# EAGLE design PoEpi_v2 (EAGLE 6.2)
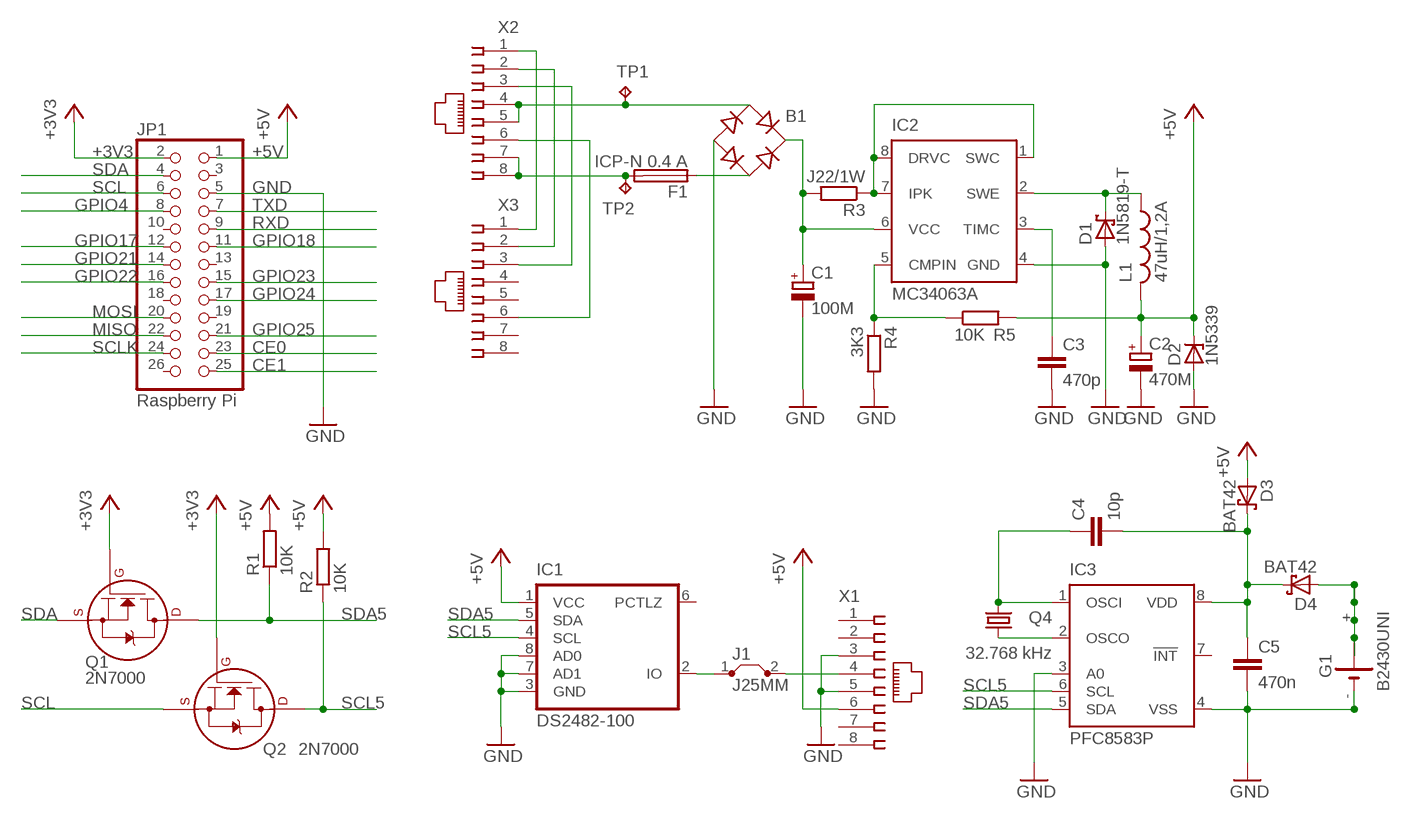
[diagram p0: schematic, sheet 1]

## Parts
B1  B-DIL  [B-DIL]
C1  100M  CPOL-EUE3.5-8  [E3,5-8]
C2  470M  CPOL-EUE3.5-8  [E3,5-8]
C3  470p  C-EU050-024X044  [C050-024X044]
C4  10p  C-EU050-024X044  [C050-024X044]
C5  470n  C-EU050-024X044  [C050-024X044]
D1  1N5819-T  [DO41-7.6]
D2  1N5339  1N5333  [C1702-15]
D3  BAT42  [DO35-10]
D4  BAT42  [DO35-10]
F1  ICP-N 0.4 A  FUSETO92-2  [TO92-2]
G1  B2430UNI  [B2430UNI]
IC1  DS2482-100  [SO08]
IC2  MC34063A  [DIL8]
IC3  PFC8583P  [DIL08]
J1  J25MM  [25]
JP1  Raspberry Pi  PINHD-2X13INV  [2X13]
L1  47uH/1,2A  L-US6000-XXX-RC  [6000-XXXX-RC]
Q1  2N7000  2N700_TO92-  [TO92-]
Q2  2N7000  2N700_TO92-  [TO92-]
Q4  32.768 kHz  CRYSTALTC26V  [TC26V]
R1  10K  R-EU_0204/7  [0204/7]
R2  10K  R-EU_0204/7  [0204/7]
R3  J22/1W  R-EU_0617/17  [0617/17]
R4  3K3  R-EU_0204/7  [0204/7]
R5  10K  R-EU_0204/7  [0204/7]
TP1  TPPAD1-13Y  [P1-13Y]
TP2  TPPAD1-13Y  [P1-13Y]
X1  520251-4  [520251-4]
X2  520251-4  [520251-4]
X3  520251-4  [520251-4]

## Nets
+3V3: JP1.2 Q1.2(G) Q2.2(G)
+5V: C2.+ D2.C D3.A IC1.1(VCC) JP1.1 L1.2 R1.2 R2.2 R5.2 X1.6
+BAT: D4.A G1.+ G1.+@1(+) G1.+@2(+) G1.+@3(+) G1.+@4(+)
+VSB: C4.2 C5.1 D3.C D4.C IC3.8(VDD)
CE0: JP1.23
CE1: JP1.25
GND: B1.- C1.- C2.- C3.2 C5.2 D1.A D2.A G1.- G1.-@1(-) IC1.3(GND) IC1.7(AD1) IC1.8(AD0) IC2.4(GND) IC3.3(A0) IC3.4(VSS) JP1.5 R4.2 X1.3 X1.5
GPIO4: JP1.8
GPIO17: JP1.12
GPIO18: JP1.11
GPIO21: JP1.14
GPIO22: JP1.16
GPIO23: JP1.15
GPIO24: JP1.17
GPIO25: JP1.21
MISO: JP1.22
MOSI: JP1.20
N$1: X2.1 X3.1
N$2: X2.2 X3.2
N$3: X2.3 X3.3
N$4: X2.6 X3.6
N$5: F1.3 TP2.TP X2.7 X2.8
N$6: B1.AC1 TP1.TP X2.4 X2.5
N$7: IC2.1(SWC) IC2.7(IPK) IC2.8(DRVC) R3.1
N$8: IC2.5(CMPIN) R4.1 R5.1
N$9: B1.+ C1.+ IC2.6(VCC) R3.2
N$10: C3.1 IC2.3(TIMC)
N$12: D1.C IC2.2(SWE) L1.1
N$14: B1.AC2 F1.1
N$15: IC3.2(OSCO) Q4.1
N$16: C4.1 IC3.1(OSCI) Q4.2
ONEWIRE: IC1.2(IO) J1.1
ONEWIRE2: J1.2 X1.4
RXD: JP1.9
SCL: JP1.6 Q2.3(S)
SCL5: IC1.4(SCL) IC3.6(SCL) Q2.1(D) R2.1
SCLK: JP1.24
SDA: JP1.4 Q1.3(S)
SDA5: IC1.5(SDA) IC3.5(SDA) Q1.1(D) R1.1
TXD: JP1.7
Unconnected: IC1.6(PCTLZ) IC3.7(!INT) JP1.3 JP1.10 JP1.13 JP1.18 JP1.19 JP1.26 X1.1 X1.2 X1.7 X1.8 X3.4 X3.5 X3.7 X3.8

## Library data of the parts
B1 = rectifier:B-DIL: RECTIFIER
C1 C2 = rcl:CPOL-EU: POLARIZED CAPACITOR, European symbol
C3-C5 = rcl:C-EU: CAPACITOR, European symbol
D1 = diode:1N581*: 1.0A SCHOTTKY BARRIER RECTIFIER Source: http://www.diodes.com/datasheets/ds23001.pdf
D2 = diode:1N5333: Z DIODE 3.3 V, 5W, 5 percent (Motorola)
D3 D4 = diode:BAT42: DIODE barrier diode
F1 = myparts:FUSE: Fuse
G1 = battery:B2430UNI: LI BATTERY
IC1 = parts:DS2482-100: Single channel 1-Wire master with I2C interface
IC2 = parts:MC34063A
IC3 = micro-philips:PFC8583: I2C-Bus CLOCK/CALENDAR; OC_FARNELL: unknown; OC_NEWARK: unknown
J1 = jumper:J: Bridge
JP1 = myparts:PINHD-2X13: PIN HEADER - INVERSED - for contacting another pinheader on stacked board
L1 = rcl:L-US: INDUCTOR, American symbol
Q1 Q2 = myparts:2N700*: 2N7000, 2N7002, NDS7002A N-channel enhancement mode MOSFET
Q4 = crystal:CRYSTAL: CRYSTAL; OC_FARNELL: unknown; OC_NEWARK: unknown
R1-R5 = rcl:R-EU_: RESISTOR, European symbol
TP1 TP2 = testpad:TP: Test pad
X1-X3 = con-amp:520251-4: AMP connector

## Board
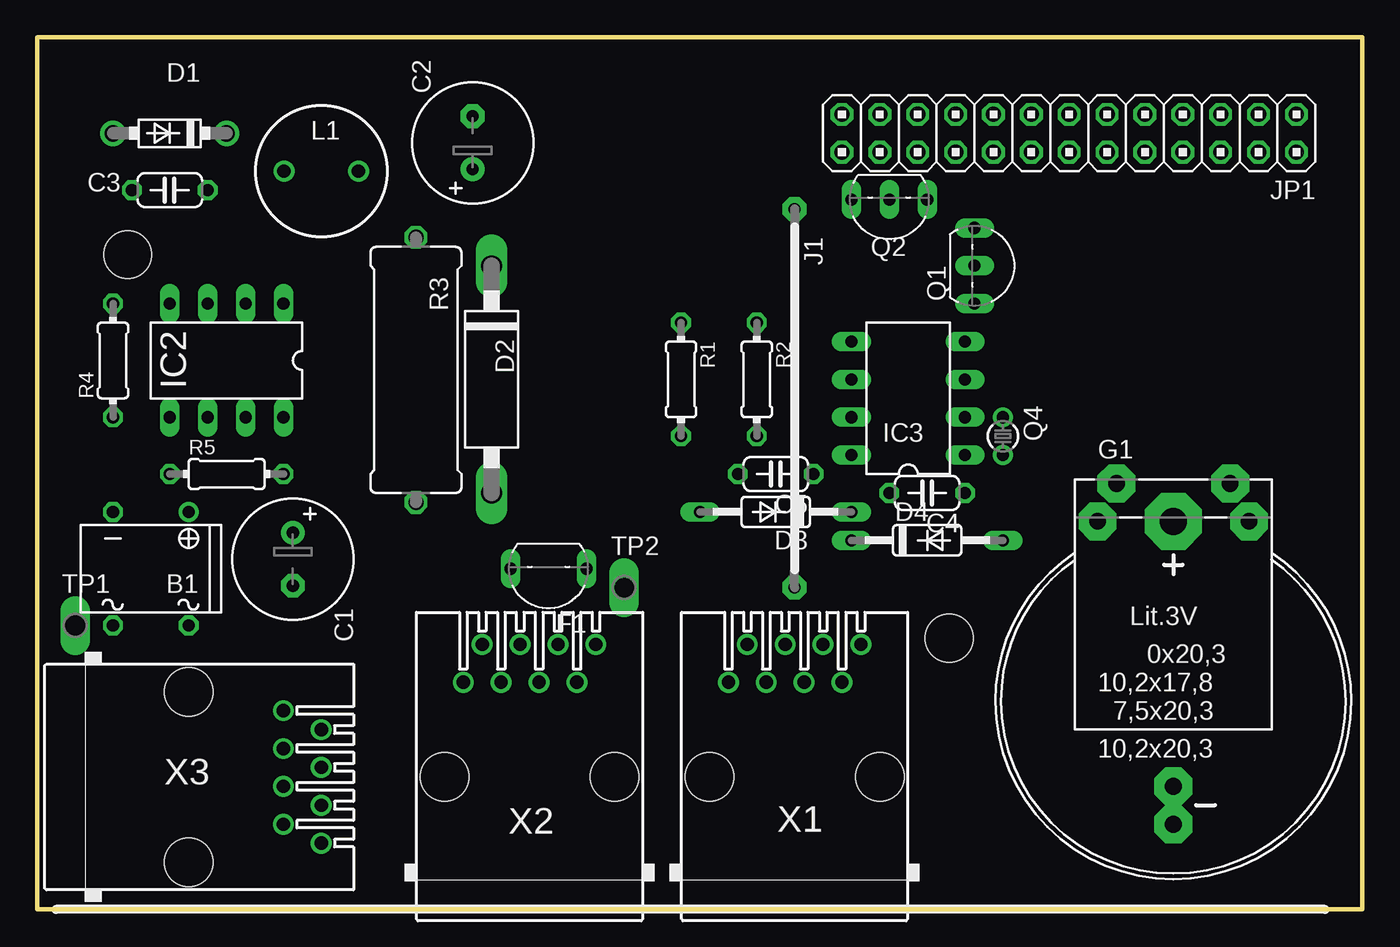
[diagram p1: board, top side]
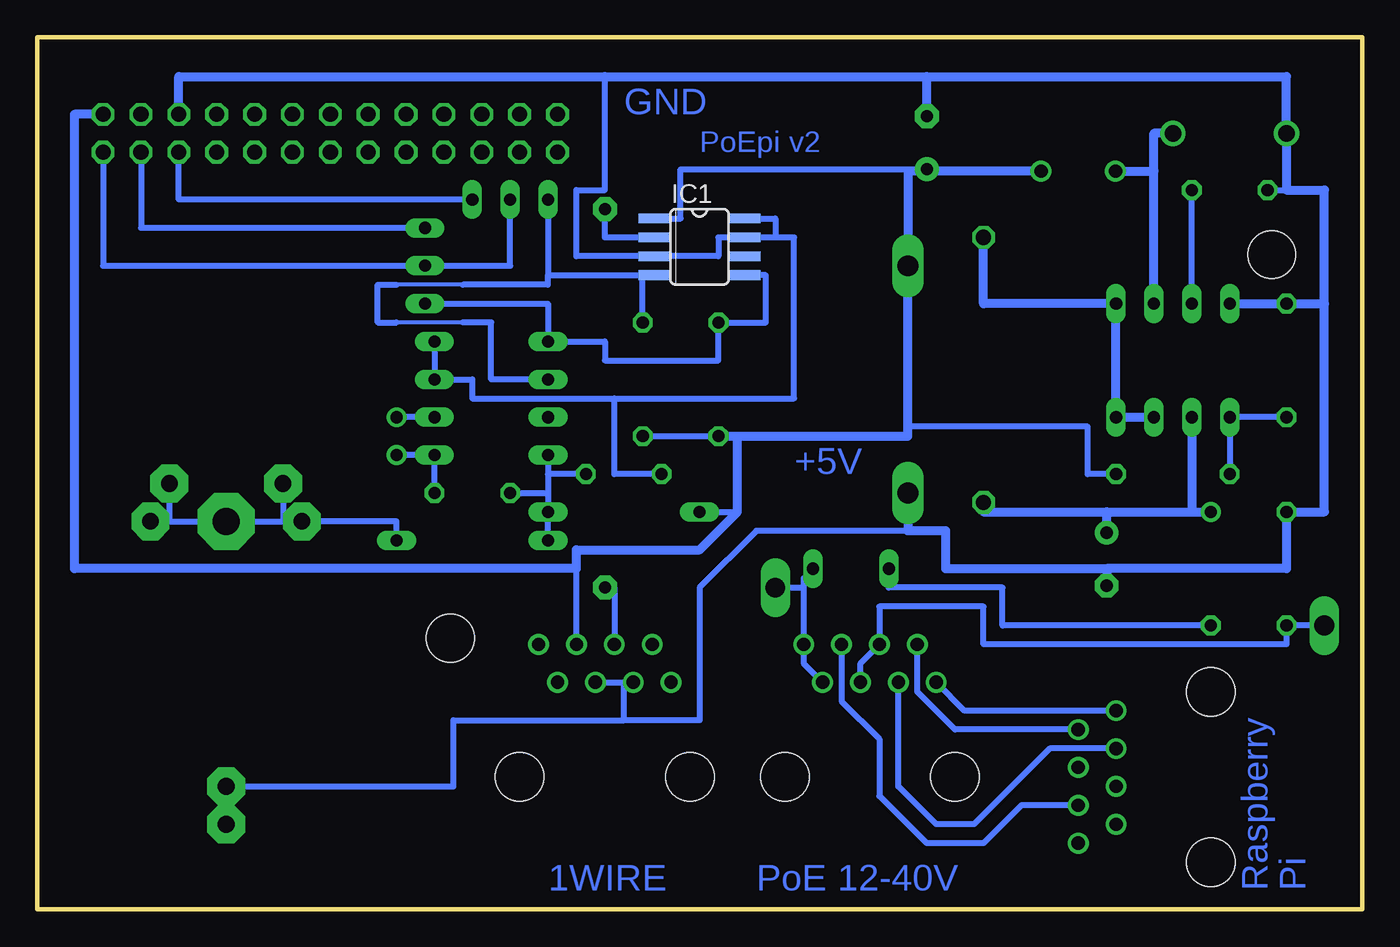
[diagram p2: board, bottom side, seen from below]

Size 88.87 x 58.51 mm. Coordinates in mm from the lower left corner, seen from the top.
Outline: 0,0 88.87,0 88.87,58.51 0,58.51 0,0
Copper layers (1*16): Top 0.035mm / dielectric 1.5mm / Bottom 0.035mm
Design rules "default": minimum track width 10mil, minimum drill 24mil, track to track 8mil, track to pad 8mil, pad to pad 8mil, via to via 8mil, smd to smd 8mil, copper to edge 40mil, drill to drill 8mil, minimum pad ring 10mil, minimum via ring 8mil, stop-mask expansion 4mil, vias tented up to drill 0mil, thermal gap 10mil
Holes 3.2 mm at 61.17,18.2 6.07,43.93

### Footprints (pad centres in the part's own frame; a part is rotated, then mirrored left to right if it is on the bottom)
B-DIL = drill 0.813: + -2.54,-3.81 | drill 0.813 octagon: - 2.54,-3.81; AC1 2.54,3.81; AC2 -2.54,3.81
E3,5-8 = drill 0.813 pad 1.6: + -1.778,0 | drill 0.813 pad 1.6 octagon: - 1.778,0
C050-024X044 = drill 0.813 octagon: 1 -2.54,0; 2 2.54,0
DO41-7.6 = drill 1.1 pad 1.7: A 3.81,0; C -3.81,0
C1702-15 = drill 1.397 long: A 7.62,0; C -7.62,0
DO35-10 = drill 0.813 long: A 5.08,0; C -5.08,0
TO92-2 = drill 0.813 long: 1 2.54,0; 3 -2.54,0
B2430UNI = drill 1.118 pad 2.54 octagon: + 3.81,14.605; +@1 -3.81,14.605; +@2 -5.08,12.065; +@3 5.08,12.065; - 0,-5.715; -@1 0,-8.255 | drill 1.803 pad 3.81 octagon: +@4 0,12.065
SO08 = smd 0.66 x 2.032: 1 -1.905,-3.073; 2 -0.635,-3.073; 3 0.635,-3.073; 4 1.905,-3.073; 5 1.905,3.073; 6 0.635,3.073; 7 -0.635,3.073; 8 -1.905,3.073
DIL8 = drill 0.813 long: 1 -3.81,-3.81; 2 -1.27,-3.81; 3 1.27,-3.81; 4 3.81,-3.81; 5 3.81,3.81; 6 1.27,3.81; 7 -1.27,3.81; 8 -3.81,3.81
DIL08 = drill 0.813 long: 1 -3.81,-3.81; 2 -1.27,-3.81; 3 1.27,-3.81; 4 3.81,-3.81; 5 3.81,3.81; 6 1.27,3.81; 7 -1.27,3.81; 8 -3.81,3.81
25 = drill 0.813 pad 1.6 octagon: 1 -12.7,0; 2 12.7,0
2X13 = drill 1.016 octagon: 1 -15.24,-1.27; 2 -15.24,1.27; 3 -12.7,-1.27; 4 -12.7,1.27; 5 -10.16,-1.27; 6 -10.16,1.27; 7 -7.62,-1.27; 8 -7.62,1.27; 9 -5.08,-1.27; 10 -5.08,1.27; 11 -2.54,-1.27; 12 -2.54,1.27; 13 0,-1.27; 14 0,1.27; 15 2.54,-1.27; 16 2.54,1.27; 17 5.08,-1.27; 18 5.08,1.27; 19 7.62,-1.27; 20 7.62,1.27; 21 10.16,-1.27; 22 10.16,1.27; 23 12.7,-1.27; 24 12.7,1.27; 25 15.24,-1.27; 26 15.24,1.27
6000-XXXX-RC = drill 0.9 pad 1.422: 1 -2.5,0; 2 2.5,0
TO92- = drill 0.813 long: 1 2.54,0; 2 0,0; 3 -2.54,0
TC26V = drill 0.813: 1 -1.27,0; 2 1.27,0
0204/7 = drill 0.813 octagon: 1 -3.81,0; 2 3.81,0
0617/17 = drill 1.016 octagon: 1 -8.89,0; 2 8.89,0
P1-13Y = drill 1.321 pad 1.905 long: TP 0,0
520251-4 = drill 0.889: 1 -4.445,6.35; 2 -3.175,8.89; 3 -1.905,6.35; 4 -0.635,8.89; 5 0.635,6.35; 6 1.905,8.89; 7 3.175,6.35; 8 4.445,8.89 | hole 3.251: -5.715,0; 5.715,0

### Placement (x,y rotation side)
B1  7.62,22.86 180 top
C1  17.14,23.5 270 top
C2  29.21,51.44 90 top
C3  8.89,48.26 180 top
C4  59.69,27.94 180 top
C5  49.53,29.21 180 top
D1  8.89,52.07 180 top
D2  30.48,35.56 270 top
D3  49.53,26.67 180 top
D4  59.69,24.77 0 top
F1  34.29,22.86 180 top
G1  76.2,13.97 0 top
IC1  44.45,44.45 270 bottom
IC2  12.7,36.83 180 top
IC3  58.42,34.29 90 top
J1  50.8,34.29 270 top
JP1  69.21,52.07 180 top
L1  19.05,49.53 0 top
Q1  62.87,43.18 270 top
Q2  57.15,47.62 180 top
Q4  64.77,31.75 270 top
R1  43.18,35.56 270 top
R2  48.26,35.56 270 top
R3  25.4,36.2 270 top
R4  5.08,36.83 90 top
R5  12.7,29.21 0 top
TP1  2.54,19.05 0 top
TP2  39.37,21.59 0 top
X1  50.8,8.89 0 top
X2  33.02,8.89 0 top
X3  10.16,8.89 270 top

### Tracks (layer width: path | path; a pad name or v marks a point on that pad's centre or on a via)
+3V3
  Bottom 0.305: Q2.2 57.15,46.99 57.15,43.81
  Bottom 0.406: JP1.2 84.45,43.18 Q1.2 57.15,43.18 57.15,46.99
+5V
  Bottom 0.406: 48.26,46.35 IC1.1 45.72,46.35 45.72,49.66 C2.+ | R5.2 18.41,29.21 18.41,32.38 30.48,32.38 | X1.6 52.71,22.86 | D3.A 41.91,26.67 | R2.2 R1.2
  Bottom 0.61: JP1.1 86.36,53.34 86.36,22.86 52.71,22.86 52.71,24.13 44.45,24.13 41.91,26.67 41.91,31.75 | L1.2 29.21,49.53 | C2.+ 29.21,49.53 | 29.21,49.53 30.48,49.53 D2.C 30.48,32.38 30.48,31.75 41.91,31.75 | R1.2 41.91,31.75
+BAT
  Bottom 0.406: G1.+@3 80.01,26.04 | 80.01,26.04 G1.+@4 72.39,26.04 | G1.+ 80.01,26.04 | 72.39,26.04 G1.+@2 64.77,26.04 D4.A | G1.+@1 72.39,26.04
+VSB
  Bottom 0.406: IC3.8 54.61,29.21 | 54.61,29.21 54.61,27.94 | C4.2 54.61,27.94 | D4.C D3.C 54.61,27.94 | C5.1 54.61,29.21
GND
  Bottom 0.406: X1.5 49.53,15.24 | 49.53,15.24 X1.3 | 49.53,12.7 49.53,15.24 | 50.8,55.88 50.8,48.26 52.71,48.26 52.71,43.81 IC1.3 43.18,43.81 43.18,45.09 IC1.7 39.37,45.09 | C3.2 5.08,48.26 | 30.48,25.4 40.64,25.4 44.45,21.59 44.45,12.7 49.53,12.7 | G1.-@1 G1.- | 76.2,8.89 G1.- | G1.- 60.96,8.26 60.96,12.7 49.53,12.7 | IC1.8 39.37,46.35 39.37,45.09 | IC3.4 IC3.3 59.69,35.56 59.69,34.29 50.17,34.29 | 50.17,34.29 38.1,34.29 38.1,45.09 39.37,45.09 | C5.2 50.17,29.21 50.17,34.29
  Bottom 0.61: 2.54,40.64 2.54,26.67 B1.- 5.08,22.86 17.14,22.86 | 2.54,40.64 R4.2 IC2.4 | 2.54,40.64 2.54,48.26 5.08,48.26 D1.A 5.08,55.88 29.21,55.88 | 29.21,55.88 50.8,55.88 79.38,55.88 JP1.5 | 17.14,22.86 C1.- | 17.14,22.86 27.94,22.86 27.94,25.4 30.48,25.4 D2.A | C2.- 29.21,55.88
N$1
  Bottom 0.406: X3.1 26.67,13.34 X2.1
N$2
  Bottom 0.406: X3.2 27.3,12.06 29.84,14.61 X2.2
N$3
  Bottom 0.406: X3.3 20.95,10.79 26.04,5.71 28.57,5.71 31.11,8.26 X2.3
N$4
  Bottom 0.406: X2.6 34.93,13.97 32.38,11.43 32.38,7.62 29.21,4.45 25.4,4.45 22.86,6.99 X3.6
N$5
  Bottom 0.406: X2.7 37.47,16.51 X2.8 37.47,21.59 | 37.47,21.59 37.47,22.23 36.83,22.23 F1.3 | TP2.TP 37.47,21.59
N$6
  Bottom 0.406: X2.5 33.66,16.51 X2.4 32.38,20.32 25.4,20.32 25.4,17.78 5.08,17.78 B1.AC1 TP1.TP
N$7
  Bottom 0.61: IC2.7 IC2.8 IC2.1 | 16.51,41.27 IC2.1 | IC2.1 25.4,40.64 R3.1
N$8
  Bottom 0.406: R4.1 IC2.5 R5.1
N$9
  Bottom 0.61: IC2.6 11.43,26.67 B1.+ 17.14,26.67 | C1.+ 17.14,26.67 | R3.2 25.4,26.67 17.14,26.67
N$10
  Bottom 0.406: IC2.3 C3.1
N$12
  Bottom 0.61: D1.C 13.97,52.07 13.97,49.53 | IC2.2 13.97,49.53 | L1.1 13.97,49.53
N$14
  Bottom 0.406: B1.AC2 24.13,19.05 24.13,21.59 31.75,21.59 F1.1
N$15
  Bottom 0.406: IC3.2 Q4.1
N$16
  Bottom 0.406: Q4.2 IC3.1 C4.1
ONEWIRE
  Bottom 0.406: IC1.2 50.8,45.09 J1.1
ONEWIRE2
  Bottom 0.406: J1.2 50.17,21.59 X1.4
SCL
  Bottom 0.406: Q2.3 79.38,47.62 JP1.6
SCL5
  Bottom 0.254: 60.33,41.91 64.77,41.91 | 60.33,39.37 64.77,39.37
  Bottom 0.406: Q2.1 54.61,42.55 | 54.61,42.55 48.26,42.55 | 48.26,42.55 IC1.4 | IC3.6 58.42,35.56 58.42,39.37 60.33,39.37 | R2.1 48.26,42.55 | 54.61,42.55 54.61,41.91 60.33,41.91 | 64.77,39.37 66.04,39.37 66.04,41.91 64.77,41.91
SDA
  Bottom 0.406: JP1.4 81.91,45.72 Q1.3
SDA5
  Bottom 0.406: IC1.5 40.01,42.55 40.01,39.37 R1.1 43.18,36.83 50.8,36.83 50.8,38.1 IC3.5 54.61,40.64 Q1.1

### Text on the board
Bottom: GND | PoEpi v2 | +5V | Pi | Raspberry | PoE 12-40V | 1WIRE